# EAGLE schematic APA106_uno_shield (EAGLE 7.4.0)
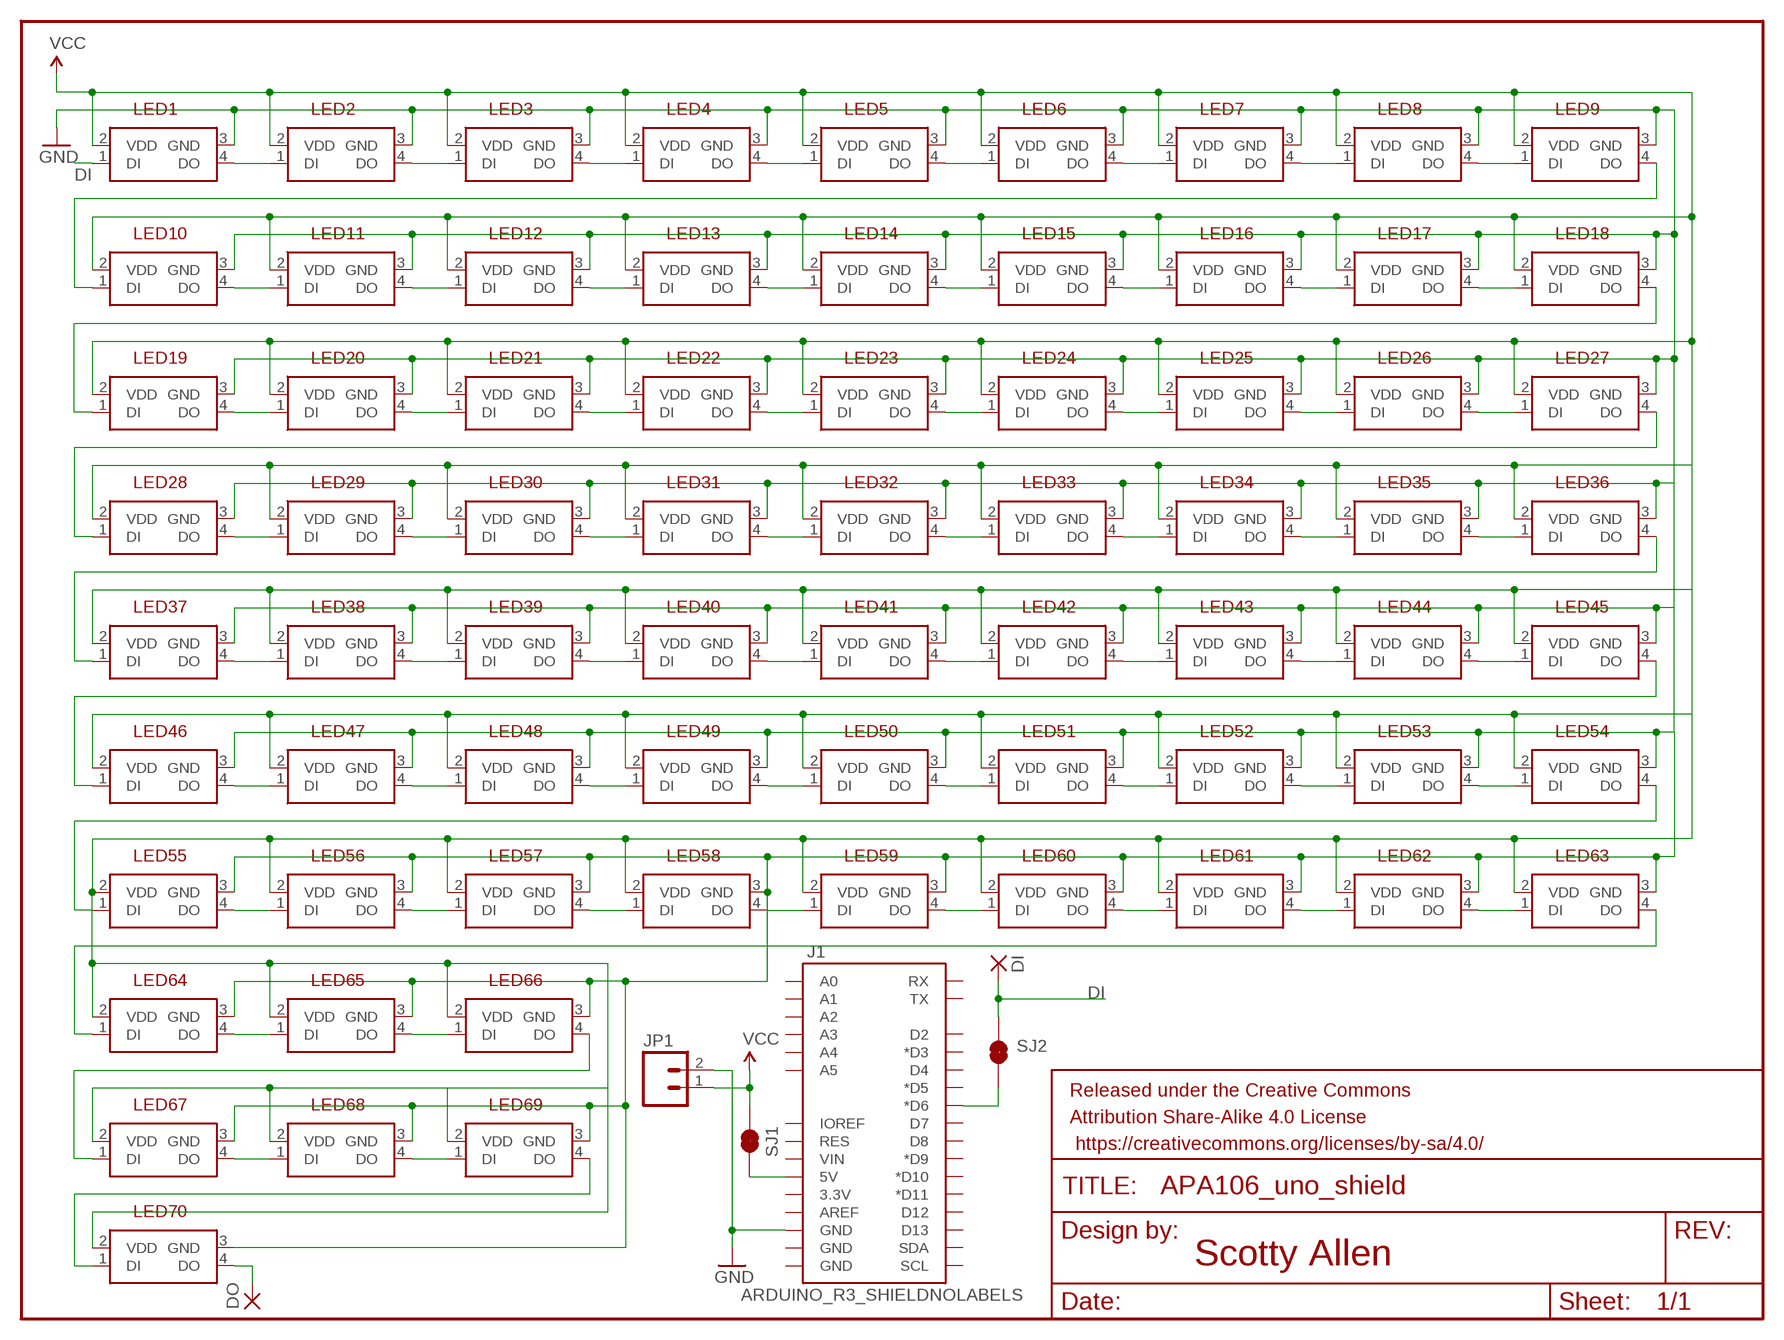
[diagram p0: schematic, sheet 1]

## Parts
DI  1,6/0,9  [1,6/0,9]
DO  1,6/0,9  [1,6/0,9]
FRAME1  FRAME-LETTER  [CREATIVE_COMMONS]
J1  ARDUINO_R3_SHIELDNOLABELS  [UNO_R3_SHIELD_NOLABELS]
JP1  M02PTH  [1X02]
LED1  LED-APA106HOLE-OFFSET  [LED-5MM-4PIN-HOLE-OFFSET]
LED2  LED-APA106HOLE-OFFSET  [LED-5MM-4PIN-HOLE-OFFSET]
LED3  LED-APA106HOLE-OFFSET  [LED-5MM-4PIN-HOLE-OFFSET]
LED4  LED-APA106HOLE-OFFSET  [LED-5MM-4PIN-HOLE-OFFSET]
LED5  LED-APA106HOLE-OFFSET  [LED-5MM-4PIN-HOLE-OFFSET]
LED6  LED-APA106HOLE-OFFSET  [LED-5MM-4PIN-HOLE-OFFSET]
LED7  LED-APA106HOLE-OFFSET  [LED-5MM-4PIN-HOLE-OFFSET]
LED8  LED-APA106HOLE-OFFSET  [LED-5MM-4PIN-HOLE-OFFSET]
LED9  LED-APA106HOLE-OFFSET  [LED-5MM-4PIN-HOLE-OFFSET]
LED10  LED-APA106HOLE-OFFSET  [LED-5MM-4PIN-HOLE-OFFSET]
LED11  LED-APA106HOLE-OFFSET  [LED-5MM-4PIN-HOLE-OFFSET]
LED12  LED-APA106HOLE-OFFSET  [LED-5MM-4PIN-HOLE-OFFSET]
LED13  LED-APA106HOLE-OFFSET  [LED-5MM-4PIN-HOLE-OFFSET]
LED14  LED-APA106HOLE-OFFSET  [LED-5MM-4PIN-HOLE-OFFSET]
LED15  LED-APA106HOLE-OFFSET  [LED-5MM-4PIN-HOLE-OFFSET]
LED16  LED-APA106HOLE-OFFSET  [LED-5MM-4PIN-HOLE-OFFSET]
LED17  LED-APA106HOLE-OFFSET  [LED-5MM-4PIN-HOLE-OFFSET]
LED18  LED-APA106HOLE-OFFSET  [LED-5MM-4PIN-HOLE-OFFSET]
LED19  LED-APA106HOLE-OFFSET  [LED-5MM-4PIN-HOLE-OFFSET]
LED20  LED-APA106HOLE-OFFSET  [LED-5MM-4PIN-HOLE-OFFSET]
LED21  LED-APA106HOLE-OFFSET  [LED-5MM-4PIN-HOLE-OFFSET]
LED22  LED-APA106HOLE-OFFSET  [LED-5MM-4PIN-HOLE-OFFSET]
LED23  LED-APA106HOLE-OFFSET  [LED-5MM-4PIN-HOLE-OFFSET]
LED24  LED-APA106HOLE-OFFSET  [LED-5MM-4PIN-HOLE-OFFSET]
LED25  LED-APA106HOLE-OFFSET  [LED-5MM-4PIN-HOLE-OFFSET]
LED26  LED-APA106HOLE-OFFSET  [LED-5MM-4PIN-HOLE-OFFSET]
LED27  LED-APA106HOLE-OFFSET  [LED-5MM-4PIN-HOLE-OFFSET]
LED28  LED-APA106HOLE-OFFSET  [LED-5MM-4PIN-HOLE-OFFSET]
LED29  LED-APA106HOLE-OFFSET  [LED-5MM-4PIN-HOLE-OFFSET]
LED30  LED-APA106HOLE-OFFSET  [LED-5MM-4PIN-HOLE-OFFSET]
LED31  LED-APA106HOLE-OFFSET  [LED-5MM-4PIN-HOLE-OFFSET]
LED32  LED-APA106HOLE-OFFSET  [LED-5MM-4PIN-HOLE-OFFSET]
LED33  LED-APA106HOLE-OFFSET  [LED-5MM-4PIN-HOLE-OFFSET]
LED34  LED-APA106HOLE-OFFSET  [LED-5MM-4PIN-HOLE-OFFSET]
LED35  LED-APA106HOLE-OFFSET  [LED-5MM-4PIN-HOLE-OFFSET]
LED36  LED-APA106HOLE-OFFSET  [LED-5MM-4PIN-HOLE-OFFSET]
LED37  LED-APA106HOLE-OFFSET  [LED-5MM-4PIN-HOLE-OFFSET]
LED38  LED-APA106HOLE-OFFSET  [LED-5MM-4PIN-HOLE-OFFSET]
LED39  LED-APA106HOLE-OFFSET  [LED-5MM-4PIN-HOLE-OFFSET]
LED40  LED-APA106HOLE-OFFSET  [LED-5MM-4PIN-HOLE-OFFSET]
LED41  LED-APA106HOLE-OFFSET  [LED-5MM-4PIN-HOLE-OFFSET]
LED42  LED-APA106HOLE-OFFSET  [LED-5MM-4PIN-HOLE-OFFSET]
LED43  LED-APA106HOLE-OFFSET  [LED-5MM-4PIN-HOLE-OFFSET]
LED44  LED-APA106HOLE-OFFSET  [LED-5MM-4PIN-HOLE-OFFSET]
LED45  LED-APA106HOLE-OFFSET  [LED-5MM-4PIN-HOLE-OFFSET]
LED46  LED-APA106HOLE-OFFSET  [LED-5MM-4PIN-HOLE-OFFSET]
LED47  LED-APA106HOLE-OFFSET  [LED-5MM-4PIN-HOLE-OFFSET]
LED48  LED-APA106HOLE-OFFSET  [LED-5MM-4PIN-HOLE-OFFSET]
LED49  LED-APA106HOLE-OFFSET  [LED-5MM-4PIN-HOLE-OFFSET]
LED50  LED-APA106HOLE-OFFSET  [LED-5MM-4PIN-HOLE-OFFSET]
LED51  LED-APA106HOLE-OFFSET  [LED-5MM-4PIN-HOLE-OFFSET]
LED52  LED-APA106HOLE-OFFSET  [LED-5MM-4PIN-HOLE-OFFSET]
LED53  LED-APA106HOLE-OFFSET  [LED-5MM-4PIN-HOLE-OFFSET]
LED54  LED-APA106HOLE-OFFSET  [LED-5MM-4PIN-HOLE-OFFSET]
LED55  LED-APA106HOLE-OFFSET  [LED-5MM-4PIN-HOLE-OFFSET]
LED56  LED-APA106HOLE-OFFSET  [LED-5MM-4PIN-HOLE-OFFSET]
LED57  LED-APA106HOLE-OFFSET  [LED-5MM-4PIN-HOLE-OFFSET]
LED58  LED-APA106HOLE-OFFSET  [LED-5MM-4PIN-HOLE-OFFSET]
LED59  LED-APA106HOLE-OFFSET  [LED-5MM-4PIN-HOLE-OFFSET]
LED60  LED-APA106HOLE-OFFSET  [LED-5MM-4PIN-HOLE-OFFSET]
LED61  LED-APA106HOLE-OFFSET  [LED-5MM-4PIN-HOLE-OFFSET]
LED62  LED-APA106HOLE-OFFSET  [LED-5MM-4PIN-HOLE-OFFSET]
LED63  LED-APA106HOLE-OFFSET  [LED-5MM-4PIN-HOLE-OFFSET]
LED64  LED-APA106HOLE-OFFSET  [LED-5MM-4PIN-HOLE-OFFSET]
LED65  LED-APA106HOLE-OFFSET  [LED-5MM-4PIN-HOLE-OFFSET]
LED66  LED-APA106HOLE-OFFSET  [LED-5MM-4PIN-HOLE-OFFSET]
LED67  LED-APA106HOLE-OFFSET  [LED-5MM-4PIN-HOLE-OFFSET]
LED68  LED-APA106HOLE-OFFSET  [LED-5MM-4PIN-HOLE-OFFSET]
LED69  LED-APA106HOLE-OFFSET  [LED-5MM-4PIN-HOLE-OFFSET]
LED70  LED-APA106HOLE-OFFSET  [LED-5MM-4PIN-HOLE-OFFSET]
SJ1  JUMPER-PAD-2-NC_BY_TRACENO_SILK  [PAD-JUMPER-2-NC_BY_TRACE_NO_SILK]
SJ2  JUMPER-PAD-2-NC_BY_TRACENO_SILK  [PAD-JUMPER-2-NC_BY_TRACE_NO_SILK]

## Nets
DI: DI.1(P) LED1.1(DI) SJ2.2
GND [power]: J1.GND@2(GND) JP1.2 LED1.3(GND) LED2.3(GND) LED3.3(GND) LED4.3(GND) LED5.3(GND) LED6.3(GND) LED7.3(GND) LED8.3(GND) LED9.3(GND) LED10.3(GND) LED11.3(GND) LED12.3(GND) LED13.3(GND) LED14.3(GND) LED15.3(GND) LED16.3(GND) LED17.3(GND) LED18.3(GND) LED19.3(GND) LED20.3(GND) LED21.3(GND) LED22.3(GND) LED23.3(GND) LED24.3(GND) LED25.3(GND) LED26.3(GND) LED27.3(GND) LED28.3(GND) LED29.3(GND) LED30.3(GND) LED31.3(GND) LED32.3(GND) LED33.3(GND) LED34.3(GND) LED35.3(GND) LED36.3(GND) LED37.3(GND) LED38.3(GND) LED39.3(GND) LED40.3(GND) LED41.3(GND) LED42.3(GND) LED43.3(GND) LED44.3(GND) LED45.3(GND) LED46.3(GND) LED47.3(GND) LED48.3(GND) LED49.3(GND) LED50.3(GND) LED51.3(GND) LED52.3(GND) LED53.3(GND) LED54.3(GND) LED55.3(GND) LED56.3(GND) LED57.3(GND) LED58.3(GND) LED59.3(GND) LED60.3(GND) LED61.3(GND) LED62.3(GND) LED63.3(GND) LED64.3(GND) LED65.3(GND) LED66.3(GND) LED67.3(GND) LED68.3(GND) LED69.3(GND) LED70.3(GND)
N$1: LED1.4(DO) LED2.1(DI)
N$2: LED2.4(DO) LED3.1(DI)
N$3: LED3.4(DO) LED4.1(DI)
N$4: LED4.4(DO) LED5.1(DI)
N$5: LED6.4(DO) LED7.1(DI)
N$6: LED7.4(DO) LED8.1(DI)
N$7: LED37.4(DO) LED38.1(DI)
N$8: LED5.4(DO) LED6.1(DI)
N$9: LED8.4(DO) LED9.1(DI)
N$10: LED10.4(DO) LED11.1(DI)
N$11: LED19.4(DO) LED20.1(DI)
N$12: LED20.4(DO) LED21.1(DI)
N$13: LED11.4(DO) LED12.1(DI)
N$14: LED12.4(DO) LED13.1(DI)
N$15: LED21.4(DO) LED22.1(DI)
N$16: LED22.4(DO) LED23.1(DI)
N$17: LED18.4(DO) LED19.1(DI)
N$18: LED23.4(DO) LED24.1(DI)
N$19: LED13.4(DO) LED14.1(DI)
N$20: LED9.4(DO) LED10.1(DI)
N$21: LED14.4(DO) LED15.1(DI)
N$22: LED15.4(DO) LED16.1(DI)
N$23: LED16.4(DO) LED17.1(DI)
N$24: LED17.4(DO) LED18.1(DI)
N$25: LED24.4(DO) LED25.1(DI)
N$26: LED25.4(DO) LED26.1(DI)
N$27: LED26.4(DO) LED27.1(DI)
N$28: LED28.4(DO) LED29.1(DI)
N$29: LED29.4(DO) LED30.1(DI)
N$30: LED30.4(DO) LED31.1(DI)
N$31: LED31.4(DO) LED32.1(DI)
N$32: LED27.4(DO) LED28.1(DI)
N$33: LED32.4(DO) LED33.1(DI)
N$34: LED33.4(DO) LED34.1(DI)
N$35: LED34.4(DO) LED35.1(DI)
N$36: LED35.4(DO) LED36.1(DI)
N$37: LED38.4(DO) LED39.1(DI)
N$38: LED39.4(DO) LED40.1(DI)
N$39: LED40.4(DO) LED41.1(DI)
N$40: LED36.4(DO) LED37.1(DI)
N$41: LED41.4(DO) LED42.1(DI)
N$42: LED42.4(DO) LED43.1(DI)
N$43: LED43.4(DO) LED44.1(DI)
N$44: LED44.4(DO) LED45.1(DI)
N$45: LED46.4(DO) LED47.1(DI)
N$46: LED47.4(DO) LED48.1(DI)
N$47: LED48.4(DO) LED49.1(DI)
N$48: LED49.4(DO) LED50.1(DI)
N$49: LED45.4(DO) LED46.1(DI)
N$50: LED50.4(DO) LED51.1(DI)
N$51: LED51.4(DO) LED52.1(DI)
N$52: LED52.4(DO) LED53.1(DI)
N$53: LED53.4(DO) LED54.1(DI)
N$54: LED55.4(DO) LED56.1(DI)
N$55: LED56.4(DO) LED57.1(DI)
N$56: LED57.4(DO) LED58.1(DI)
N$57: LED58.4(DO) LED59.1(DI)
N$58: LED54.4(DO) LED55.1(DI)
N$59: LED59.4(DO) LED60.1(DI)
N$60: LED60.4(DO) LED61.1(DI)
N$61: LED61.4(DO) LED62.1(DI)
N$62: LED62.4(DO) LED63.1(DI)
N$63: LED64.4(DO) LED65.1(DI)
N$64: LED65.4(DO) LED66.1(DI)
N$65: LED67.4(DO) LED68.1(DI)
N$66: LED63.4(DO) LED64.1(DI)
N$67: LED68.4(DO) LED69.1(DI)
N$68: LED66.4(DO) LED67.1(DI)
N$69: LED69.4(DO) LED70.1(DI)
N$70 [power]: J1.5V SJ1.1
N$71: DO.1(P) LED70.4(DO)
N$72: J1.D6(*D6) SJ2.1
VCC [power]: JP1.1 LED1.2(VDD) LED2.2(VDD) LED3.2(VDD) LED4.2(VDD) LED5.2(VDD) LED6.2(VDD) LED7.2(VDD) LED8.2(VDD) LED9.2(VDD) LED10.2(VDD) LED11.2(VDD) LED12.2(VDD) LED13.2(VDD) LED14.2(VDD) LED15.2(VDD) LED16.2(VDD) LED17.2(VDD) LED18.2(VDD) LED19.2(VDD) LED20.2(VDD) LED21.2(VDD) LED22.2(VDD) LED23.2(VDD) LED24.2(VDD) LED25.2(VDD) LED26.2(VDD) LED27.2(VDD) LED28.2(VDD) LED29.2(VDD) LED30.2(VDD) LED31.2(VDD) LED32.2(VDD) LED33.2(VDD) LED34.2(VDD) LED35.2(VDD) LED36.2(VDD) LED37.2(VDD) LED38.2(VDD) LED39.2(VDD) LED40.2(VDD) LED41.2(VDD) LED42.2(VDD) LED43.2(VDD) LED44.2(VDD) LED45.2(VDD) LED46.2(VDD) LED47.2(VDD) LED48.2(VDD) LED49.2(VDD) LED50.2(VDD) LED51.2(VDD) LED52.2(VDD) LED53.2(VDD) LED54.2(VDD) LED55.2(VDD) LED56.2(VDD) LED57.2(VDD) LED58.2(VDD) LED59.2(VDD) LED60.2(VDD) LED61.2(VDD) LED62.2(VDD) LED63.2(VDD) LED64.2(VDD) LED65.2(VDD) LED66.2(VDD) LED67.2(VDD) LED68.2(VDD) LED69.2(VDD) LED70.2(VDD) SJ1.2
Unconnected: J1.3.3V J1.A0 J1.A1 J1.A2 J1.A3 J1.A4 J1.A5 J1.AREF J1.D2 J1.D3(*D3) J1.D4 J1.D5(*D5) J1.D7 J1.D8 J1.D9(*D9) J1.D10(*D10) J1.D11(*D11) J1.D12 J1.D13 J1.GND@0(GND) J1.GND@1(GND) J1.IOREF J1.RES J1.RX J1.SCL J1.SDA J1.TX J1.VIN

## Library data of the parts
DI DO = wirepad:1,6/0,9: THROUGH-HOLE PAD
FRAME1 = SparkFun-Aesthetics:FRAME-LETTER: Schematic Frame Standard 8.5x11 US Letter frame
J1 = scotty:ARDUINO_R3_SHIELD: Shield form compatible with the Arduino Uno R3.
JP1 = SparkFun-Connectors:M02: Standard 2-pin 0.1" header. Use with - straight break away headers ( PRT-00116) - right angle break away headers (PRT-00553) - swiss pins (PRT-00743) - machine pins (PRT-00117) - female headers (PRT-00115) Molex polarized connector foot print use with: PRT-08233 with associated crimp pins and housings. 2.54_SCREWTERM for use with PRT-10571. 3.5mm Screw Terminal footprints for PRT-08084 5mm Screw Terminal footprints for use with PRT-08432
LED1-LED70 = scotty:LED-APA106
SJ1 SJ2 = scotty:JUMPER-PAD-2-NC_BY_TRACE

## Net classes
0 default: width 0.254 mm
1 power: width 1.27 mm